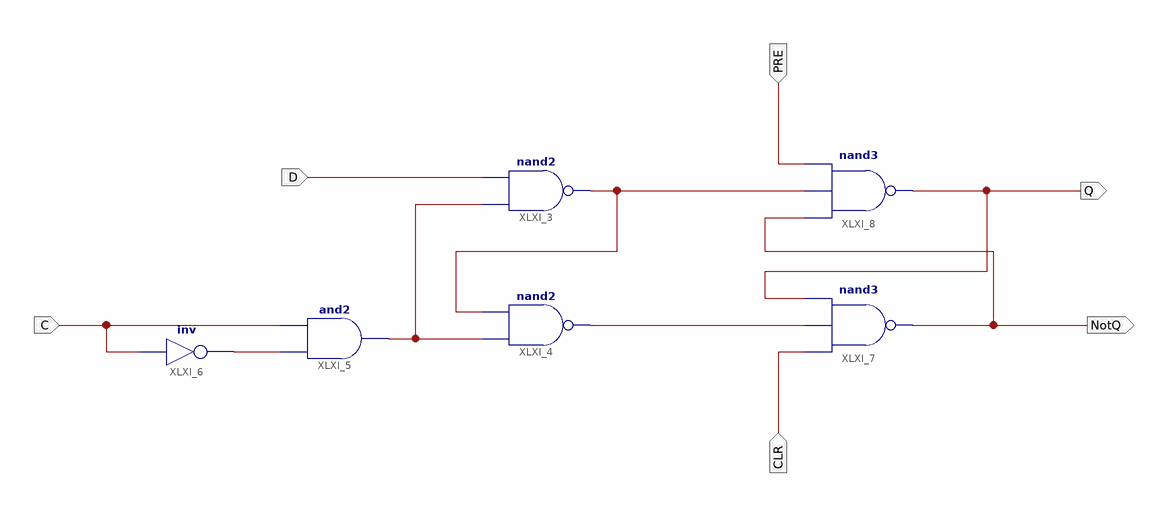
[diagram p0: schematic sheet 1]
// Xilinx ISE schematic asyncFlipFlop.sch (kintex7) as structural Verilog: 6 symbols, 6 ports
module asyncFlipFlop (
  input  C,
  input  PRE,
  input  CLR,
  input  D,
  output Q,
  output NotQ
);

  wire XLXN_1, XLXN_5, XLXN_9, XLXN_15;

  nand XLXI_3 (XLXN_15, XLXN_9, D);
  nand XLXI_4 (XLXN_5, XLXN_9, XLXN_15);
  and XLXI_5 (XLXN_9, XLXN_1, C);
  not XLXI_6 (XLXN_1, C);
  nand XLXI_7 (NotQ, CLR, XLXN_5, Q);
  nand XLXI_8 (Q, NotQ, XLXN_15, PRE);
endmodule
